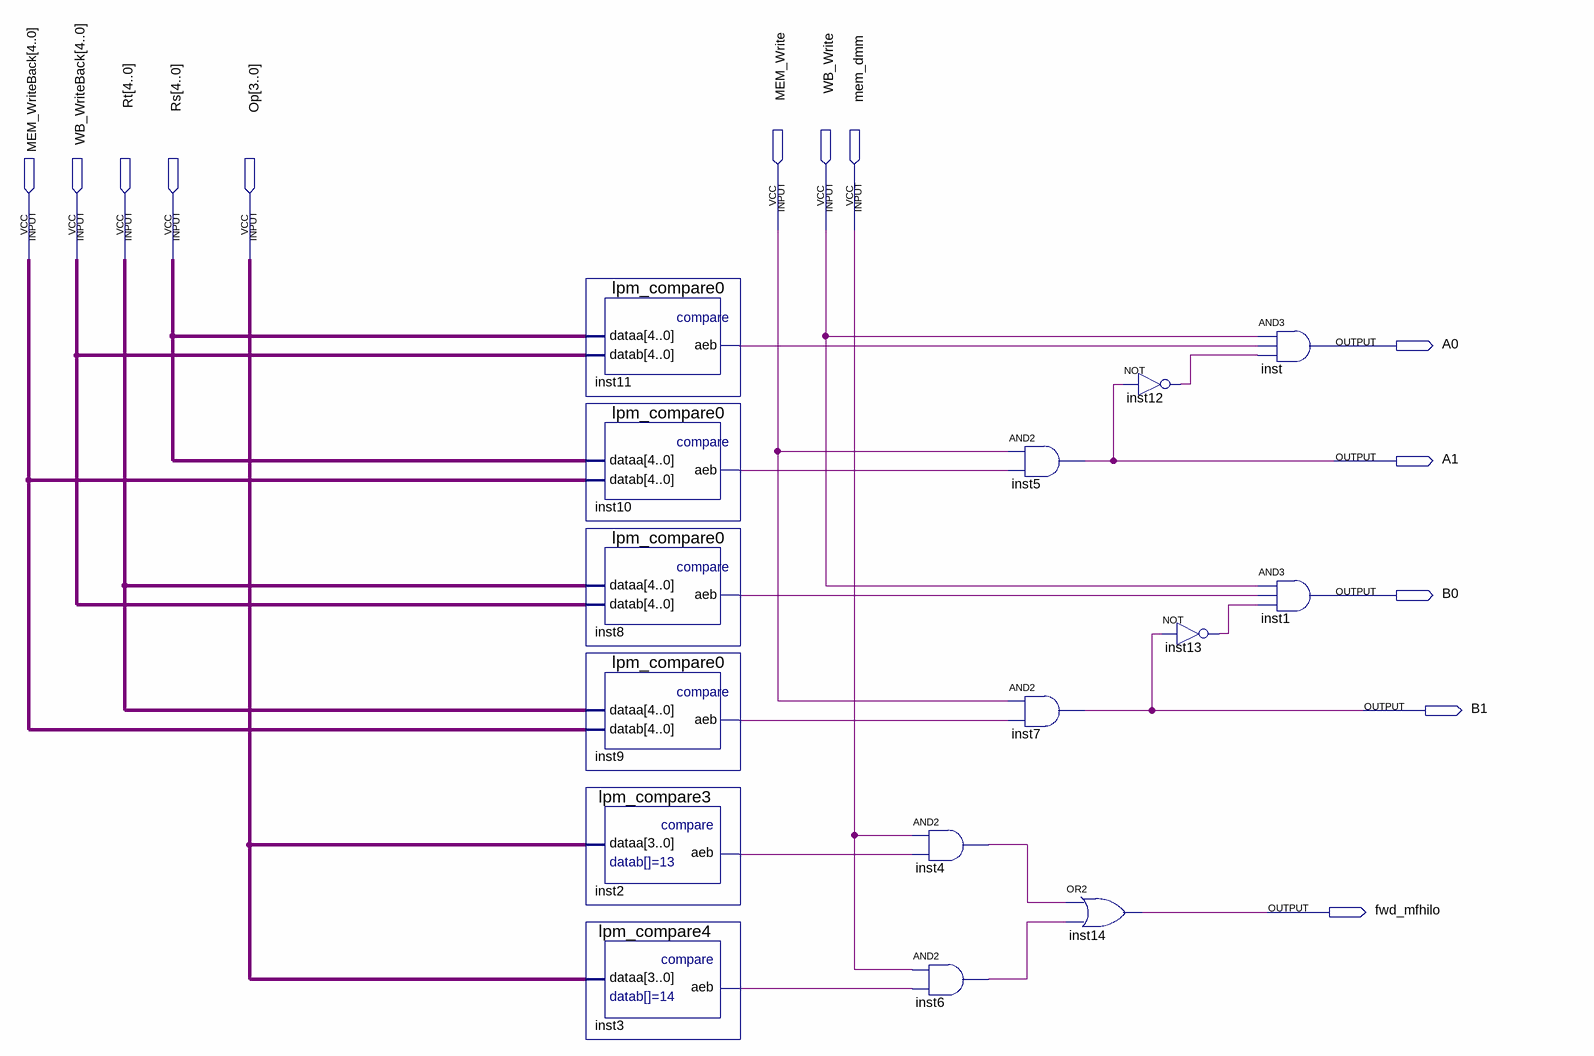
[diagram p0: schematic sheet]
// Quartus schematic Forward.bdf as structural Verilog: 15 symbols, 13 pins
module Forward (
  input  MEM_Write,
  input  WB_Write,
  input  mem_dmm,
  input  [4:0] MEM_WriteBack,
  input  [4:0] WB_WriteBack,
  input  [4:0] Rt,
  input  [4:0] Rs,
  input  [3:0] Op,
  output A0,
  output A1,
  output B0,
  output B1,
  output fwd_mfhilo
);

  wire inst2_aeb, inst3_aeb, inst4_out, inst6_out, inst8_aeb, inst9_aeb, inst10_aeb, inst11_aeb, inst12_out,
       inst13_out;

  lpm_compare0 inst11 (.dataa(Rs), .datab(WB_WriteBack), .aeb(inst11_aeb));
  lpm_compare0 inst10 (.dataa(Rs), .datab(MEM_WriteBack), .aeb(inst10_aeb));
  lpm_compare0 inst8 (.dataa(Rt), .datab(WB_WriteBack), .aeb(inst8_aeb));
  lpm_compare0 inst9 (.dataa(Rt), .datab(MEM_WriteBack), .aeb(inst9_aeb));
  lpm_compare3 inst2 (.dataa(Op), .aeb(inst2_aeb));
  lpm_compare4 inst3 (.dataa(Op), .aeb(inst3_aeb));
  and inst4 (inst4_out, mem_dmm, inst2_aeb);
  and inst6 (inst6_out, mem_dmm, inst3_aeb);
  and inst5 (A1, MEM_Write, inst10_aeb);
  and inst7 (B1, MEM_Write, inst9_aeb);
  or inst14 (fwd_mfhilo, inst4_out, inst6_out);
  not inst12 (inst12_out, A1);
  not inst13 (inst13_out, B1);
  and inst (A0, WB_Write, inst11_aeb, inst12_out);
  and inst1 (B0, WB_Write, inst8_aeb, inst13_out);
endmodule
